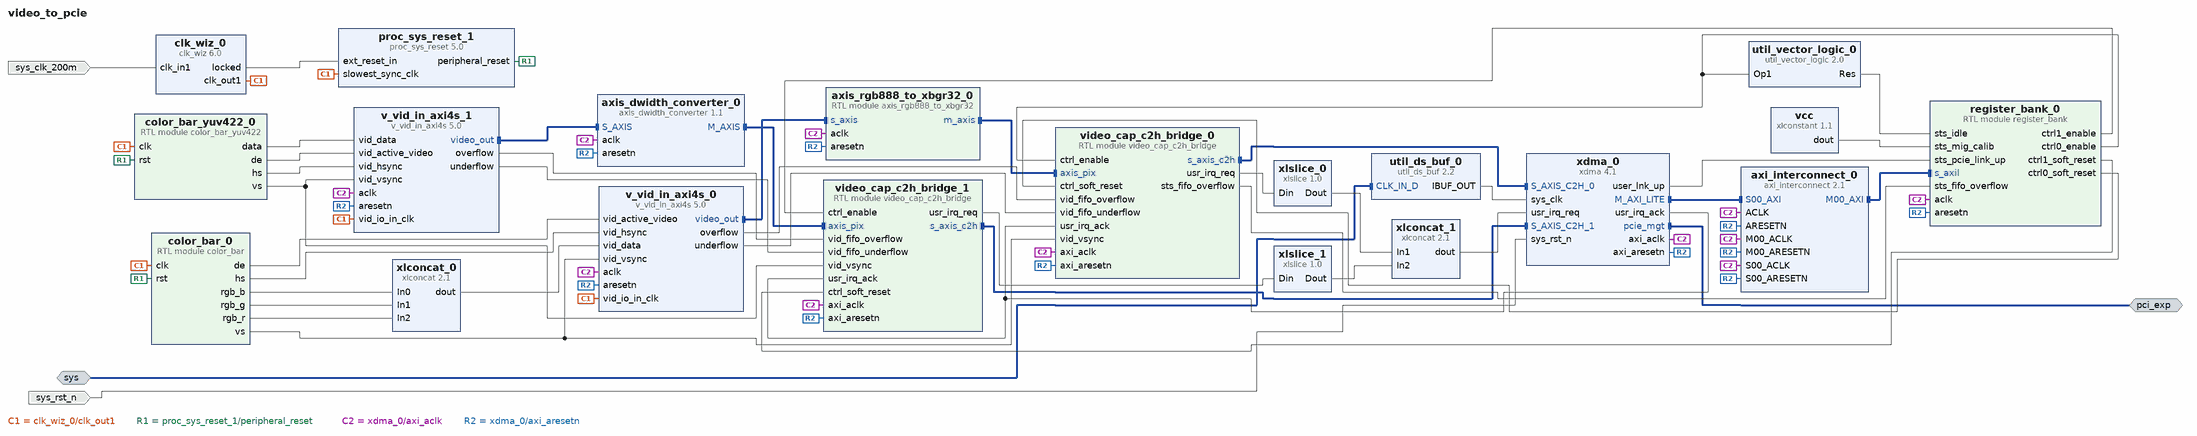
[diagram p0: block diagram of the top level]
# Vivado block design video_to_pcie, xc7k480tffg1156-2, Vivado 2024.2
create_bd_design video_to_pcie

create_bd_intf_port -mode Slave -vlnv xilinx.com:interface:diff_clock_rtl:1.0 sys
create_bd_intf_port -mode Master -vlnv xilinx.com:interface:pcie_7x_mgt_rtl:1.0 pci_exp
create_bd_port -dir I -type rst sys_rst_n
create_bd_port -dir I -type clk sys_clk_200m
set_property -dict {CONFIG.FREQ_HZ 200000000} [get_bd_ports sys_clk_200m]

create_bd_cell -type module -reference video_cap_c2h_bridge video_cap_c2h_bridge_0
set_property -dict {CONFIG.USER_IRQ_WIDTH 4} [get_bd_cells video_cap_c2h_bridge_0]
create_bd_cell -type module -reference color_bar color_bar_0
create_bd_cell -type module -reference register_bank register_bank_0
create_bd_cell -type ip -vlnv xilinx.com:ip:xdma:4.1 xdma_0
set_property -dict [list \
  CONFIG.axilite_master_en true \
  CONFIG.cfg_mgmt_if false \
  CONFIG.pf0_base_class_menu Multimedia_device \
  CONFIG.pf0_msix_enabled true \
  CONFIG.pf0_sub_class_interface_menu Video_device \
  CONFIG.pl_link_cap_max_link_speed 5.0_GT/s \
  CONFIG.pl_link_cap_max_link_width X8 \
  CONFIG.xdma_axi_intf_mm AXI_Stream \
  CONFIG.xdma_num_usr_irq 4 \
  CONFIG.xdma_rnum_chnl 2 \
  CONFIG.xdma_wnum_chnl 2 \
] [get_bd_cells xdma_0]
create_bd_cell -type ip -vlnv xilinx.com:ip:clk_wiz:6.0 clk_wiz_0
set_property -dict [list \
  CONFIG.CLKIN1_JITTER_PS 50.0 \
  CONFIG.CLKOUT1_JITTER 215.720 \
  CONFIG.CLKOUT1_PHASE_ERROR 245.344 \
  CONFIG.CLKOUT1_REQUESTED_OUT_FREQ 148.5 \
  CONFIG.MMCM_CLKFBOUT_MULT_F 37.125 \
  CONFIG.MMCM_CLKIN1_PERIOD 5.000 \
  CONFIG.MMCM_CLKIN2_PERIOD 10.0 \
  CONFIG.MMCM_CLKOUT0_DIVIDE_F 6.250 \
  CONFIG.MMCM_DIVCLK_DIVIDE 8 \
  CONFIG.PRIM_IN_FREQ 200.000 \
  CONFIG.PRIM_SOURCE Single_ended_clock_capable_pin \
  CONFIG.USE_RESET false \
] [get_bd_cells clk_wiz_0]
create_bd_cell -type ip -vlnv xilinx.com:ip:v_vid_in_axi4s:5.0 v_vid_in_axi4s_0
set_property -dict {CONFIG.C_ADDR_WIDTH 13 CONFIG.C_HAS_ASYNC_CLK 1} [get_bd_cells v_vid_in_axi4s_0]
create_bd_cell -type ip -vlnv xilinx.com:ip:axi_interconnect:2.1 axi_interconnect_0
set_property -dict {CONFIG.NUM_MI 1} [get_bd_cells axi_interconnect_0]
create_bd_cell -type ip -vlnv xilinx.com:ip:util_ds_buf:2.2 util_ds_buf_0
set_property -dict {CONFIG.C_BUF_TYPE IBUFDSGTE} [get_bd_cells util_ds_buf_0]
create_bd_cell -type ip -vlnv xilinx.com:ip:util_vector_logic:2.0 util_vector_logic_0
set_property -dict {CONFIG.C_OPERATION not CONFIG.C_SIZE 1} [get_bd_cells util_vector_logic_0]
create_bd_cell -type ip -vlnv xilinx.com:ip:xlconstant:1.1 vcc
create_bd_cell -type ip -vlnv xilinx.com:ip:proc_sys_reset:5.0 proc_sys_reset_1
create_bd_cell -type ip -vlnv xilinx.com:ip:xlconcat:2.1 xlconcat_0
set_property -dict {CONFIG.NUM_PORTS 3} [get_bd_cells xlconcat_0]
create_bd_cell -type module -reference color_bar_yuv422 color_bar_yuv422_0
create_bd_cell -type ip -vlnv xilinx.com:ip:v_vid_in_axi4s:5.0 v_vid_in_axi4s_1
set_property -dict [list \
  CONFIG.C_ADDR_WIDTH 13 \
  CONFIG.C_HAS_ASYNC_CLK 1 \
  CONFIG.C_M_AXIS_VIDEO_FORMAT 0 \
] [get_bd_cells v_vid_in_axi4s_1]
create_bd_cell -type module -reference axis_rgb888_to_xbgr32 axis_rgb888_to_xbgr32_0
create_bd_cell -type ip -vlnv xilinx.com:ip:axis_dwidth_converter:1.1 axis_dwidth_converter_0
set_property -dict {CONFIG.M_TDATA_NUM_BYTES 4 CONFIG.TUSER_BITS_PER_BYTE 1} [get_bd_cells axis_dwidth_converter_0]
create_bd_cell -type module -reference video_cap_c2h_bridge video_cap_c2h_bridge_1
set_property -dict {CONFIG.USER_IRQ_WIDTH 4 CONFIG.VSYNC_IRQ_BIT 2} [get_bd_cells video_cap_c2h_bridge_1]
create_bd_cell -type ip -vlnv xilinx.com:ip:xlconcat:2.1 xlconcat_1
set_property -dict {CONFIG.NUM_PORTS 4} [get_bd_cells xlconcat_1]
create_bd_cell -type ip -vlnv xilinx.com:ip:xlslice:1.0 xlslice_0
set_property -dict {CONFIG.DIN_FROM 1 CONFIG.DIN_TO 1 CONFIG.DIN_WIDTH 4} [get_bd_cells xlslice_0]
create_bd_cell -type ip -vlnv xilinx.com:ip:xlslice:1.0 xlslice_1
set_property -dict {CONFIG.DIN_FROM 2 CONFIG.DIN_TO 2 CONFIG.DIN_WIDTH 4} [get_bd_cells xlslice_1]

# ---- connections ----

connect_bd_intf_net -intf_net CLK_IN_D_0_1 [get_bd_intf_ports sys] [get_bd_intf_pins util_ds_buf_0/CLK_IN_D]
connect_bd_intf_net [get_bd_intf_pins axi_interconnect_0/S00_AXI] [get_bd_intf_pins xdma_0/M_AXI_LITE]
connect_bd_intf_net [get_bd_intf_pins register_bank_0/s_axil] [get_bd_intf_pins axi_interconnect_0/M00_AXI]
connect_bd_intf_net [get_bd_intf_pins video_cap_c2h_bridge_1/axis_pix] [get_bd_intf_pins axis_dwidth_converter_0/M_AXIS]
connect_bd_intf_net [get_bd_intf_pins video_cap_c2h_bridge_0/axis_pix] [get_bd_intf_pins axis_rgb888_to_xbgr32_0/m_axis]
connect_bd_intf_net [get_bd_intf_pins axis_rgb888_to_xbgr32_0/s_axis] [get_bd_intf_pins v_vid_in_axi4s_0/video_out]
connect_bd_intf_net [get_bd_intf_pins axis_dwidth_converter_0/S_AXIS] [get_bd_intf_pins v_vid_in_axi4s_1/video_out]
connect_bd_intf_net [get_bd_intf_pins xdma_0/S_AXIS_C2H_0] [get_bd_intf_pins video_cap_c2h_bridge_0/s_axis_c2h]
connect_bd_intf_net [get_bd_intf_pins video_cap_c2h_bridge_1/s_axis_c2h] [get_bd_intf_pins xdma_0/S_AXIS_C2H_1]
connect_bd_intf_net [get_bd_intf_ports pci_exp] [get_bd_intf_pins xdma_0/pcie_mgt]
connect_bd_net [get_bd_pins clk_wiz_0/clk_out1] \
  [get_bd_pins color_bar_0/clk] [get_bd_pins v_vid_in_axi4s_0/vid_io_in_clk] [get_bd_pins proc_sys_reset_1/slowest_sync_clk] \
  [get_bd_pins v_vid_in_axi4s_1/vid_io_in_clk] [get_bd_pins color_bar_yuv422_0/clk]
connect_bd_net -net clk_in1_0_1 [get_bd_ports sys_clk_200m] [get_bd_pins clk_wiz_0/clk_in1]
connect_bd_net [get_bd_pins clk_wiz_0/locked] [get_bd_pins proc_sys_reset_1/ext_reset_in]
connect_bd_net [get_bd_pins color_bar_0/de] [get_bd_pins v_vid_in_axi4s_0/vid_active_video]
connect_bd_net [get_bd_pins color_bar_0/hs] [get_bd_pins v_vid_in_axi4s_0/vid_hsync]
connect_bd_net [get_bd_pins color_bar_0/rgb_b] [get_bd_pins xlconcat_0/In0]
connect_bd_net [get_bd_pins color_bar_0/rgb_g] [get_bd_pins xlconcat_0/In1]
connect_bd_net [get_bd_pins color_bar_0/rgb_r] [get_bd_pins xlconcat_0/In2]
connect_bd_net [get_bd_pins color_bar_0/vs] [get_bd_pins v_vid_in_axi4s_0/vid_vsync] [get_bd_pins video_cap_c2h_bridge_0/vid_vsync]
connect_bd_net [get_bd_pins color_bar_yuv422_0/data] [get_bd_pins v_vid_in_axi4s_1/vid_data]
connect_bd_net [get_bd_pins color_bar_yuv422_0/de] [get_bd_pins v_vid_in_axi4s_1/vid_active_video]
connect_bd_net [get_bd_pins color_bar_yuv422_0/hs] [get_bd_pins v_vid_in_axi4s_1/vid_hsync]
connect_bd_net [get_bd_pins color_bar_yuv422_0/vs] [get_bd_pins v_vid_in_axi4s_1/vid_vsync] [get_bd_pins video_cap_c2h_bridge_1/vid_vsync]
connect_bd_net [get_bd_pins proc_sys_reset_1/peripheral_reset] [get_bd_pins color_bar_0/rst] [get_bd_pins color_bar_yuv422_0/rst]
connect_bd_net [get_bd_pins register_bank_0/ctrl1_enable] [get_bd_pins video_cap_c2h_bridge_1/ctrl_enable]
connect_bd_net [get_bd_pins register_bank_0/ctrl1_soft_reset] [get_bd_pins video_cap_c2h_bridge_1/ctrl_soft_reset]
connect_bd_net -net register_bank_0_ctrl_enable [get_bd_pins register_bank_0/ctrl0_enable] \
  [get_bd_pins util_vector_logic_0/Op1] [get_bd_pins video_cap_c2h_bridge_0/ctrl_enable]
connect_bd_net -net register_bank_0_ctrl_soft_reset [get_bd_pins register_bank_0/ctrl0_soft_reset] \
  [get_bd_pins video_cap_c2h_bridge_0/ctrl_soft_reset]
connect_bd_net -net sys_rst_n_0_1 [get_bd_ports sys_rst_n] [get_bd_pins xdma_0/sys_rst_n]
connect_bd_net [get_bd_pins util_ds_buf_0/IBUF_OUT] [get_bd_pins xdma_0/sys_clk]
connect_bd_net [get_bd_pins util_vector_logic_0/Res] [get_bd_pins register_bank_0/sts_idle]
connect_bd_net [get_bd_pins v_vid_in_axi4s_0/overflow] [get_bd_pins video_cap_c2h_bridge_0/vid_fifo_overflow]
connect_bd_net [get_bd_pins v_vid_in_axi4s_0/underflow] [get_bd_pins video_cap_c2h_bridge_0/vid_fifo_underflow]
connect_bd_net [get_bd_pins v_vid_in_axi4s_1/overflow] [get_bd_pins video_cap_c2h_bridge_1/vid_fifo_overflow]
connect_bd_net [get_bd_pins v_vid_in_axi4s_1/underflow] [get_bd_pins video_cap_c2h_bridge_1/vid_fifo_underflow]
connect_bd_net [get_bd_pins video_cap_c2h_bridge_0/sts_fifo_overflow] [get_bd_pins register_bank_0/sts_fifo_overflow]
connect_bd_net [get_bd_pins video_cap_c2h_bridge_0/usr_irq_req] [get_bd_pins xlslice_0/Din]
connect_bd_net [get_bd_pins video_cap_c2h_bridge_1/usr_irq_req] [get_bd_pins xlslice_1/Din]
connect_bd_net [get_bd_pins xdma_0/axi_aclk] \
  [get_bd_pins v_vid_in_axi4s_0/aclk] [get_bd_pins axi_interconnect_0/ACLK] [get_bd_pins axi_interconnect_0/S00_ACLK] \
  [get_bd_pins axi_interconnect_0/M00_ACLK] [get_bd_pins v_vid_in_axi4s_1/aclk] [get_bd_pins axis_rgb888_to_xbgr32_0/aclk] \
  [get_bd_pins axis_dwidth_converter_0/aclk] [get_bd_pins register_bank_0/aclk] [get_bd_pins video_cap_c2h_bridge_0/axi_aclk] \
  [get_bd_pins video_cap_c2h_bridge_1/axi_aclk]
connect_bd_net [get_bd_pins xdma_0/axi_aresetn] \
  [get_bd_pins axi_interconnect_0/ARESETN] [get_bd_pins axi_interconnect_0/M00_ARESETN] \
  [get_bd_pins axi_interconnect_0/S00_ARESETN] [get_bd_pins v_vid_in_axi4s_0/aresetn] [get_bd_pins v_vid_in_axi4s_1/aresetn] \
  [get_bd_pins axis_rgb888_to_xbgr32_0/aresetn] [get_bd_pins axis_dwidth_converter_0/aresetn] \
  [get_bd_pins register_bank_0/aresetn] [get_bd_pins video_cap_c2h_bridge_0/axi_aresetn] \
  [get_bd_pins video_cap_c2h_bridge_1/axi_aresetn]
connect_bd_net [get_bd_pins xdma_0/user_lnk_up] [get_bd_pins register_bank_0/sts_pcie_link_up]
connect_bd_net [get_bd_pins xdma_0/usr_irq_ack] [get_bd_pins video_cap_c2h_bridge_1/usr_irq_ack] [get_bd_pins video_cap_c2h_bridge_0/usr_irq_ack]
connect_bd_net [get_bd_pins xlconcat_0/dout] [get_bd_pins v_vid_in_axi4s_0/vid_data]
connect_bd_net [get_bd_pins xlconcat_1/dout] [get_bd_pins xdma_0/usr_irq_req]
connect_bd_net -net xlconstant_0_dout [get_bd_pins vcc/dout] [get_bd_pins register_bank_0/sts_mig_calib]
connect_bd_net [get_bd_pins xlslice_0/Dout] [get_bd_pins xlconcat_1/In1]
connect_bd_net [get_bd_pins xlslice_1/Dout] [get_bd_pins xlconcat_1/In2]

# ---- address map ----
assign_bd_address -offset 0x00000000 -range 64K -target_address_space [get_bd_addr_spaces xdma_0/M_AXI_LITE] [get_bd_addr_segs register_bank_0/s_axil/reg0]

validate_bd_design
save_bd_design
